# EAGLE schematic schematic (EAGLE 9.6.2)
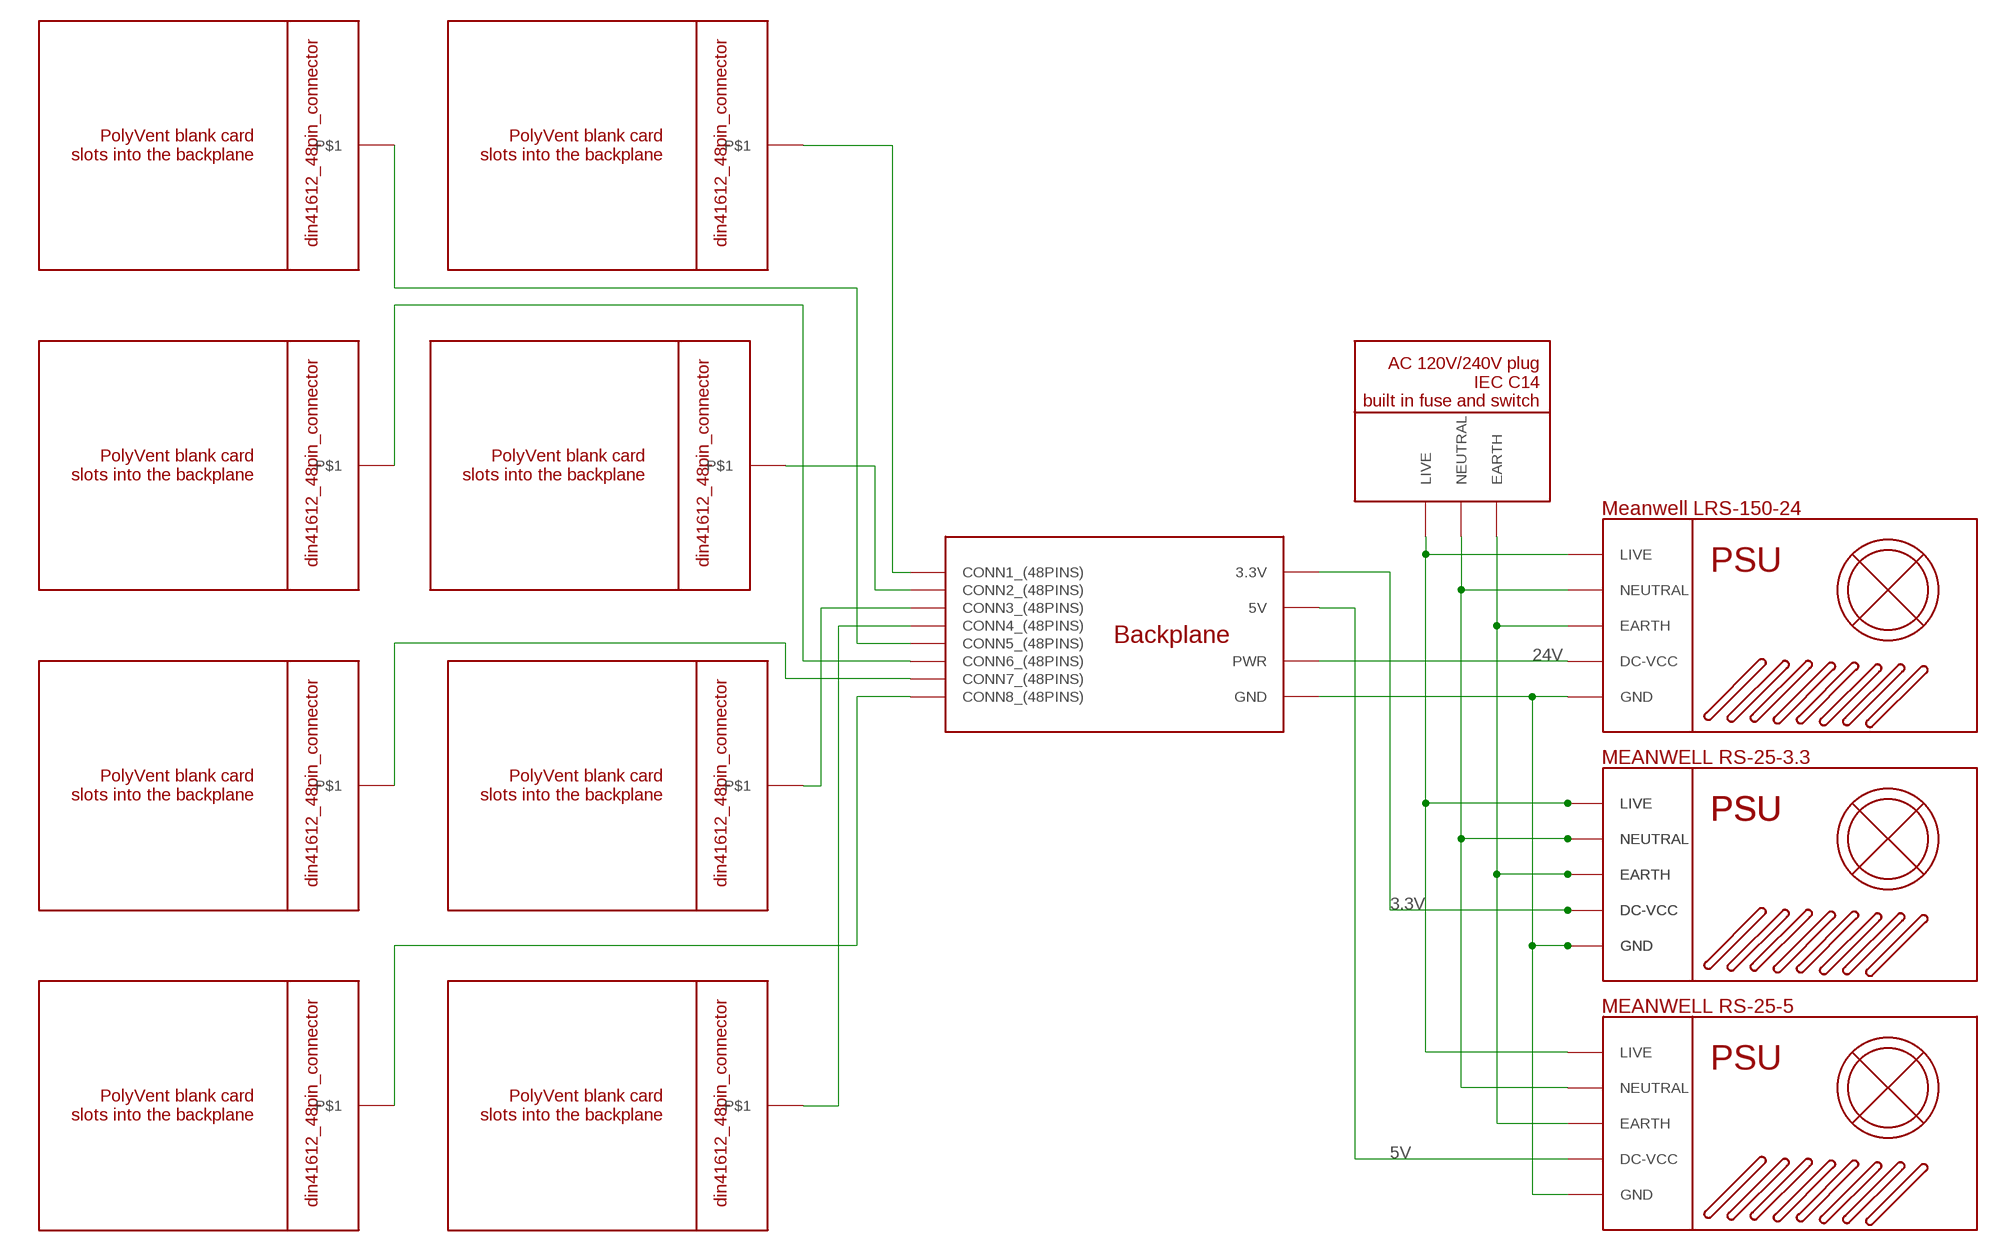
[diagram p0: schematic, sheet 1]

## Parts
U$1  BACKPLANE  (no package)
U$2  POWER_PLUG_WITH_FUSE_AND_SWITCH  (no package)
U$3  MEANWELL LRS-150-24  PSU  (no package)
U$4  MEANWELL RS-25-3.3  PSU  (no package)
U$5  MEANWELL RS-25-5  PSU  (no package)
U$6  MEANWELL RS-25-3.3  PSU  (no package)
U$7  BLANK_CARD  (no package)
U$8  BLANK_CARD  (no package)
U$9  BLANK_CARD  (no package)
U$10  BLANK_CARD  (no package)
U$11  BLANK_CARD  (no package)
U$12  BLANK_CARD  (no package)
U$13  BLANK_CARD  (no package)
U$14  BLANK_CARD  (no package)

## Nets
3.3V: U$1.3.3V U$4.DC-VCC U$6.DC-VCC
5V: U$1.5V U$5.DC-VCC
24V: U$1.PWR U$3.DC-VCC
N$1: U$2.EARTH U$3.EARTH U$4.EARTH U$5.EARTH U$6.EARTH
N$2: U$2.NEUTRAL U$3.NEUTRAL U$4.NEUTRAL U$5.NEUTRAL U$6.NEUTRAL
N$3: U$2.LIVE U$3.LIVE U$4.LIVE U$5.LIVE U$6.LIVE
N$4: U$1.CONN1_(48PINS) U$7.P$1
N$5: U$1.GND U$3.GND U$4.GND U$5.GND U$6.GND
N$6: U$1.CONN2_(48PINS) U$8.P$1
N$7: U$1.CONN3_(48PINS) U$9.P$1
N$8: U$1.CONN4_(48PINS) U$10.P$1
N$9: U$1.CONN5_(48PINS) U$14.P$1
N$10: U$1.CONN6_(48PINS) U$13.P$1
N$11: U$1.CONN7_(48PINS) U$12.P$1
N$12: U$1.CONN8_(48PINS) U$11.P$1

## Notes on the sheet
- Meanwell LRS-150-24
- MEANWELL RS-25-3.3
- MEANWELL RS-25-5

## Library data of the parts
U$1 = polyvent card schematics:BACKPLANE
U$2 = polyvent card schematics:POWER_PLUG_WITH_FUSE_AND_SWITCH
U$3-U$6 = polyvent card schematics:PSU
U$7-U$14 = polyvent card schematics:BLANK_CARD

## Net classes
1 POWER: clearance 0.508 mm